# EAGLE design v1.0_r1 (EAGLE 9.6.2)
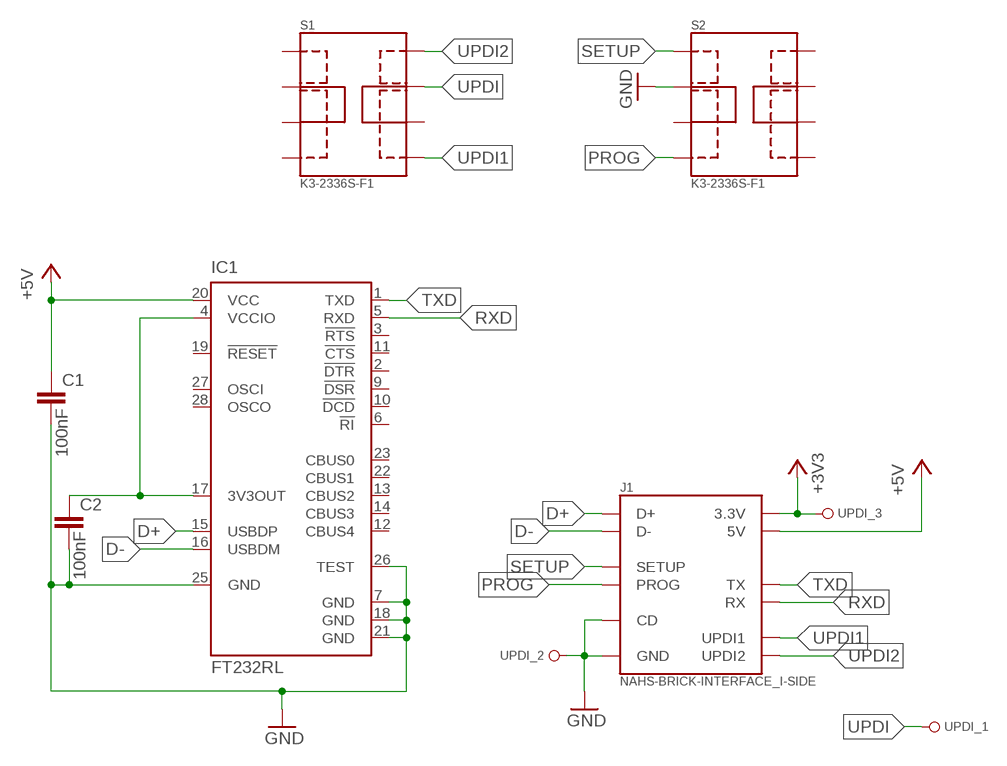
[diagram p0: schematic, sheet 1]

## Parts
C1  100nF  C-EUC0805  [C0805]
C2  100nF  C-EUC0805  [C0805]
IC1  FT232RL  [SSOP28]
J1  NAHS-BRICK-INTERFACE_I-SIDE  [54102-0164]
S1  K3-2336S-F1  [K3-2336S-F1]
S2  K3-2336S-F1  [K3-2336S-F1]
UPDI  PINHD_1X03_R_1  [1X03_R_1]

## Nets
+3V3: J1.16(3.3V) UPDI.3
+5V: C1.1 IC1.20(VCC) J1.5(5V) J1.6(5V)
D+: IC1.15(USBDP) J1.9(D+)
D-: IC1.16(USBDM) J1.10(D-)
GND: C1.2 C2.2 IC1.7(GND) IC1.18(GND) IC1.21(GND) IC1.25(GND) IC1.26(TEST) J1.11(GND) J1.12(GND) J1.13(CD) S2.1.2 UPDI.2
N$1: C2.1 IC1.4(VCCIO) IC1.17(3V3OUT)
PROG: J1.1(PROG) S2.1.4
RXD: IC1.5(RXD) J1.7(RX)
SETUP: J1.2(SETUP) S2.1.1
TXD: IC1.1(TXD) J1.8(TX)
UPDI: S1.2.2 UPDI.1
UPDI1: J1.15(UPDI1) S1.2.4
UPDI2: J1.14(UPDI2) S1.2.1
Unconnected: IC1.2(!DTR) IC1.3(!RTS) IC1.6(!RI) IC1.9(!DSR) IC1.10(!DCD) IC1.11(!CTS) IC1.12(CBUS4) IC1.13(CBUS2) IC1.14(CBUS3) IC1.19(!RESET) IC1.22(CBUS1) IC1.23(CBUS0) IC1.27(OSCI) IC1.28(OSCO) S1.1.1 S1.1.2 S1.1.3 S1.1.4 S1.2.3 S2.1.3 S2.2.1 S2.2.2 S2.2.3 S2.2.4

## Library data of the parts
C1 C2 = rcl:C-EU: CAPACITOR, European symbol; SPICEPREFIX: C
IC1 = ftdichip:FT232R: Source: http://www.ftdichip.com/Documents/DataSheets/DS_FT232R_v104.pdf; MPN: FT232RL; OC_FARNELL: 1146032; OC_NEWARK: 91K9918
J1 = no_molex:NAHS-BRICK-INTERFACE: NAHS-Brick-Interface zum Programmieren und Konfigurieren von Bricks. B-SIDE Variant ist der Verbinder auf Brick-Seite I-SIDE Variant ist der Verbinder auf Interface-Seite
S1 S2 = no_reichelt:K3-2336S-F1
UPDI = no_pinhd:PINHD_1X03; DRILL: 1mm; PADSHAPE: round

## Board
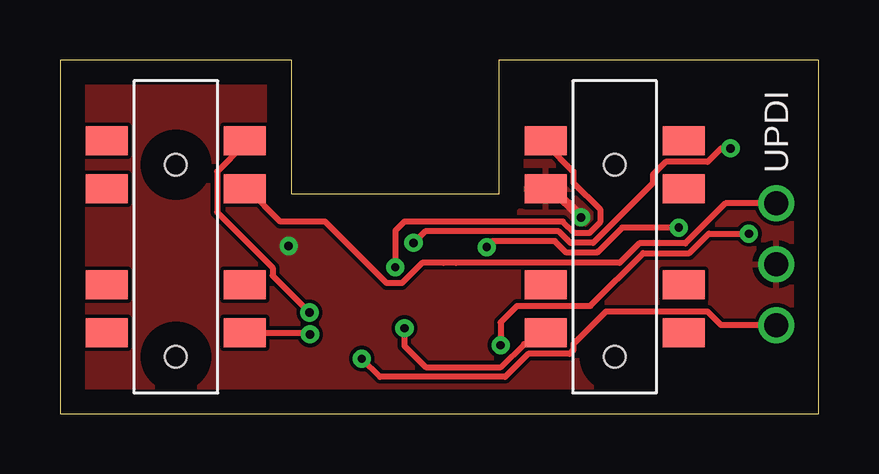
[diagram p1: board, top side]
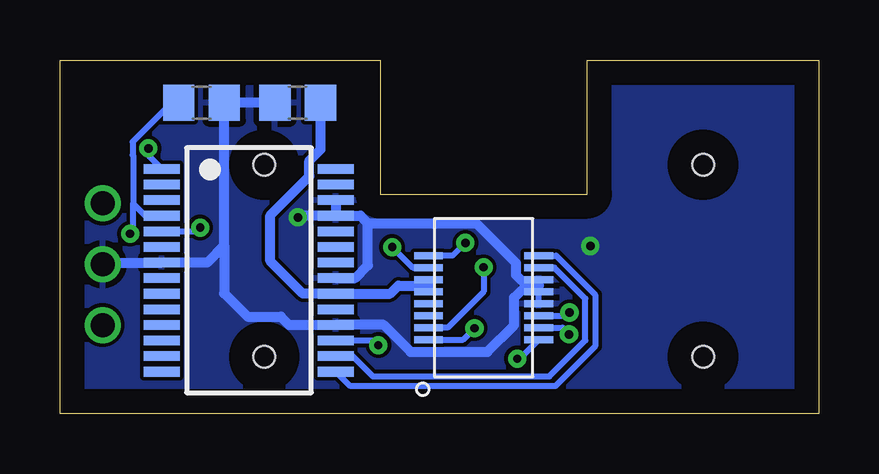
[diagram p2: board, bottom side, seen from below]

Size 31.62 x 14.73 mm. Coordinates in mm from the lower left corner, seen from the top.
Outline: 0,0 31.62,0 31.62,14.73 18.29,14.73 18.29,9.14 9.65,9.14 9.65,14.73 0,14.73 0,0
Copper layers (1*16): Top 0.035mm / dielectric 1.5mm / Bottom 0.035mm
Design rules "JLCPCB": minimum track width 6mil, minimum drill 0.3mm, track to track 6mil, track to pad 6mil, pad to pad 6mil, via to via 6mil, smd to smd 6mil, copper to edge 40mil, drill to drill 8mil, minimum pad ring 10mil, minimum via ring 8mil, stop-mask expansion 4mil, vias tented up to drill 0mil, thermal gap 10mil

### Footprints (pad centres in the part's own frame; a part is rotated, then mirrored left to right if it is on the bottom)
C0805 = smd 1.3 x 1.5: 1 -0.95,0; 2 0.95,0
SSOP28 = smd 0.4 x 1.5: 1 -4.225,-3.625; 2 -3.575,-3.625; 3 -2.925,-3.625; 4 -2.275,-3.625; 5 -1.625,-3.625; 6 -0.975,-3.625; 7 -0.325,-3.625; 8 0.325,-3.625; 9 0.975,-3.625; 10 1.625,-3.625; 11 2.275,-3.625; 12 2.925,-3.625; 13 3.575,-3.625; 14 4.225,-3.625; 15 4.225,3.625; 16 3.575,3.625; 17 2.925,3.625; 18 2.275,3.625; 19 1.625,3.625; 20 0.975,3.625; 21 0.325,3.625; 22 -0.325,3.625; 23 -0.975,3.625; 24 -1.625,3.625; 25 -2.275,3.625; 26 -2.925,3.625; 27 -3.575,3.625; 28 -4.225,3.625
54102-0164 = smd 0.3 x 1.2: 1 1.75,-2.3; 2 1.25,-2.3; 3 0.75,-2.3; 4 0.25,-2.3; 5 -0.25,-2.3; 6 -0.75,-2.3; 7 -1.25,-2.3; 8 -1.75,-2.3; 9 -1.75,2.3; 10 -1.25,2.3; 11 -0.75,2.3; 12 -0.25,2.3; 13 0.25,2.3; 14 0.75,2.3; 15 1.25,2.3; 16 1.75,2.3
K3-2336S-F1 = smd 1.2 x 1.75: 1.1 -4,-2.875; 1.2 -2,-2.875; 1.3 2,-2.875; 1.4 4,-2.875; 2.1 -4,2.875; 2.2 -2,2.875; 2.3 2,2.875; 2.4 4,2.875 | hole 0.9: -3,0; 5,0
1X03_R_1 = drill 1: 1 0,0; 2 2.54,0; 3 5.08,0

### Placement (x,y rotation side)
C1  21.72,12.95 180 bottom
C2  25.73,12.95 0 bottom
IC1  23.75,5.97 270 bottom
J1  13.97,4.83 270 bottom
S1  4.83,7.37 270 top
S2  23.11,7.37 270 top
UPDI  29.84,8.76 270 top

### Tracks (layer width: path | path; a pad name or v marks a point on that pad's centre or on a via)
+3V3  (via drill 0.35)
  Top 0.254: UPDI.3 27.54,3.68 26.98,4.25 22.74,4.25 21.39,2.9 21.39,2.65 21.23,2.49 19.5,2.49 18.54,1.52 13.34,1.52 v12.57,2.29
  Bottom 0.254: v12.57,2.29 12.46,2.29 J1.16
+5V
  Bottom 0.254: J1.6 16.27,5.33 J1.5
  Bottom 0.406: 16.27,5.33 17.53,5.33 17.87,4.99 IC1.20 21.5,4.99 22.86,6.35 22.86,8.26 21.23,9.89 21.23,10.54 20.77,11 C1.1
D+
  Bottom 0.254: J1.9 10.95,6.58 9.33,4.96 9.33,2.8 10.98,1.14 19.52,1.14 IC1.15
D-
  Bottom 0.254: J1.10 11.03,6.08 9.74,4.79 9.74,3.05 11.24,1.55 18.58,1.55 19.43,2.39 IC1.16
GND  (via drill 0.35)
  Top 0.406: v21.71,8.18 20.52,9.37 S2.1.2
  Bottom 0.254: J1.11 11.67,5.33 J1.12 J1.13
  Bottom 0.406: UPDI.2 29.77,6.29 IC1.7 25.49,6.29 24.78,7 | IC1.26 IC1.25 | IC1.25 19.11,8.24 18.79,7.92 | 24.78,7 24.78,5.01 23.8,4.04 22.42,4.04 22.08,3.69 IC1.18 18.14,3.69 17.02,2.57 13.81,2.57 12.7,3.68 12.7,4.83 12.19,5.33 12.18,5.33 | IC1.21 19.32,5.64 18.79,6.17 18.79,7.92 | IC1.25 21.64,8.24 v21.71,8.18 | 11.67,5.33 12.18,5.33 | 12.18,5.33 12.63,5.78 12.63,6.28 14.28,7.92 18.79,7.92 | C1.2 C2.2 24.78,7
  other vias: 9.53,6.99
  pour Top: 0,0 31.75,0 31.75,14.73 18.29,14.73 18.29,9.14 9.65,9.14 9.65,14.73 0,14.73
  pour Bottom: 0,0 31.75,0 31.75,15.24 17.78,15.24 17.78,10.16 10.16,10.16 10.16,15.24 0,15.24
N$1  (via drill 0.35)
  Top 0.254: v28.7,7.49 27.03,7.49 26.22,6.68 24.3,6.68 22.1,4.49 19.05,4.49 18.36,3.8 v18.36,2.85
  Bottom 0.254: 28.57,8.75 28.07,8.24 IC1.4 | v28.7,7.49 28.57,7.62 28.57,8.75 | 28.57,8.75 28.57,10.75 28.6,10.78 28.6,11.32 28.21,11.7 28.21,11.71 26.96,12.95 C2.1 | v18.36,2.85 18.56,3.04 IC1.17
PROG  (via drill 0.35)
  Top 0.254: S2.1.4 19.77,2.89 19.34,2.89 18.37,1.93 15.24,1.93 14.35,2.82 v14.35,3.56
  Bottom 0.254: J1.1 14.83,3.08 v14.35,3.56
RXD  (via drill 0.35)
  Top 0.254: v25.78,7.75 23.43,7.75 22.45,6.76 22.39,6.71 21.1,6.71 20.62,7.19 18.03,7.19 v17.78,6.94
  Bottom 0.254: IC1.5 25.93,7.59 v25.78,7.75 | v17.78,6.94 16.92,6.08 J1.7
SETUP  (via drill 0.35)
  Top 0.254: S2.1.1 20.24,11.24 21.39,10.08 21.39,9.62 22.5,8.52 22.5,7.97 22.05,7.52 21.44,7.52 20.95,8 14.35,8 13.97,7.62 v13.97,6.1
  Bottom 0.254: J1.2 15.47,3.58 13.97,5.08 v13.97,6.1
TXD  (via drill 0.35)
  Top 0.254: v27.94,11.05 27.54,11.05 26.98,10.49 25.24,10.49 24.71,9.95 24.71,9.6 22.22,7.11 21.27,7.11 20.79,7.59 15.21,7.59 v14.73,7.11
  Bottom 0.254: IC1.1 27.94,10.76 v27.94,11.05 | v14.73,7.11 15.27,6.58 J1.8
UPDI
  Top 0.254: UPDI.1 27.73,8.76 26.05,7.09 24.13,7.09 23.32,6.28 16.51,6.28 15.97,6.28 15.08,6.28 14.24,5.44 13.61,5.44 11.05,8 9.18,8 7.81,9.37 S1.2.2
UPDI1  (via drill 0.35)
  Top 0.254: S1.2.4 10.35,3.37 v10.41,3.3
  Bottom 0.254: J1.15 10.69,3.58 v10.41,3.3
UPDI2  (via drill 0.35)
  Top 0.254: v10.39,4.21 8.86,5.75 8.86,6.08 6.55,8.39 6.55,10.08 7.7,11.24 S1.2.1
  Bottom 0.254: J1.14 10.53,4.08 v10.39,4.21

### Text on the board
tDocu: U2 | S | B | - | U1 | P | +
bDocu: NAHS-Brick / -Interface | v1.0 R1 / by NiJO's